# EAGLE design AJH_as3340_20 (EAGLE 9.5.2)
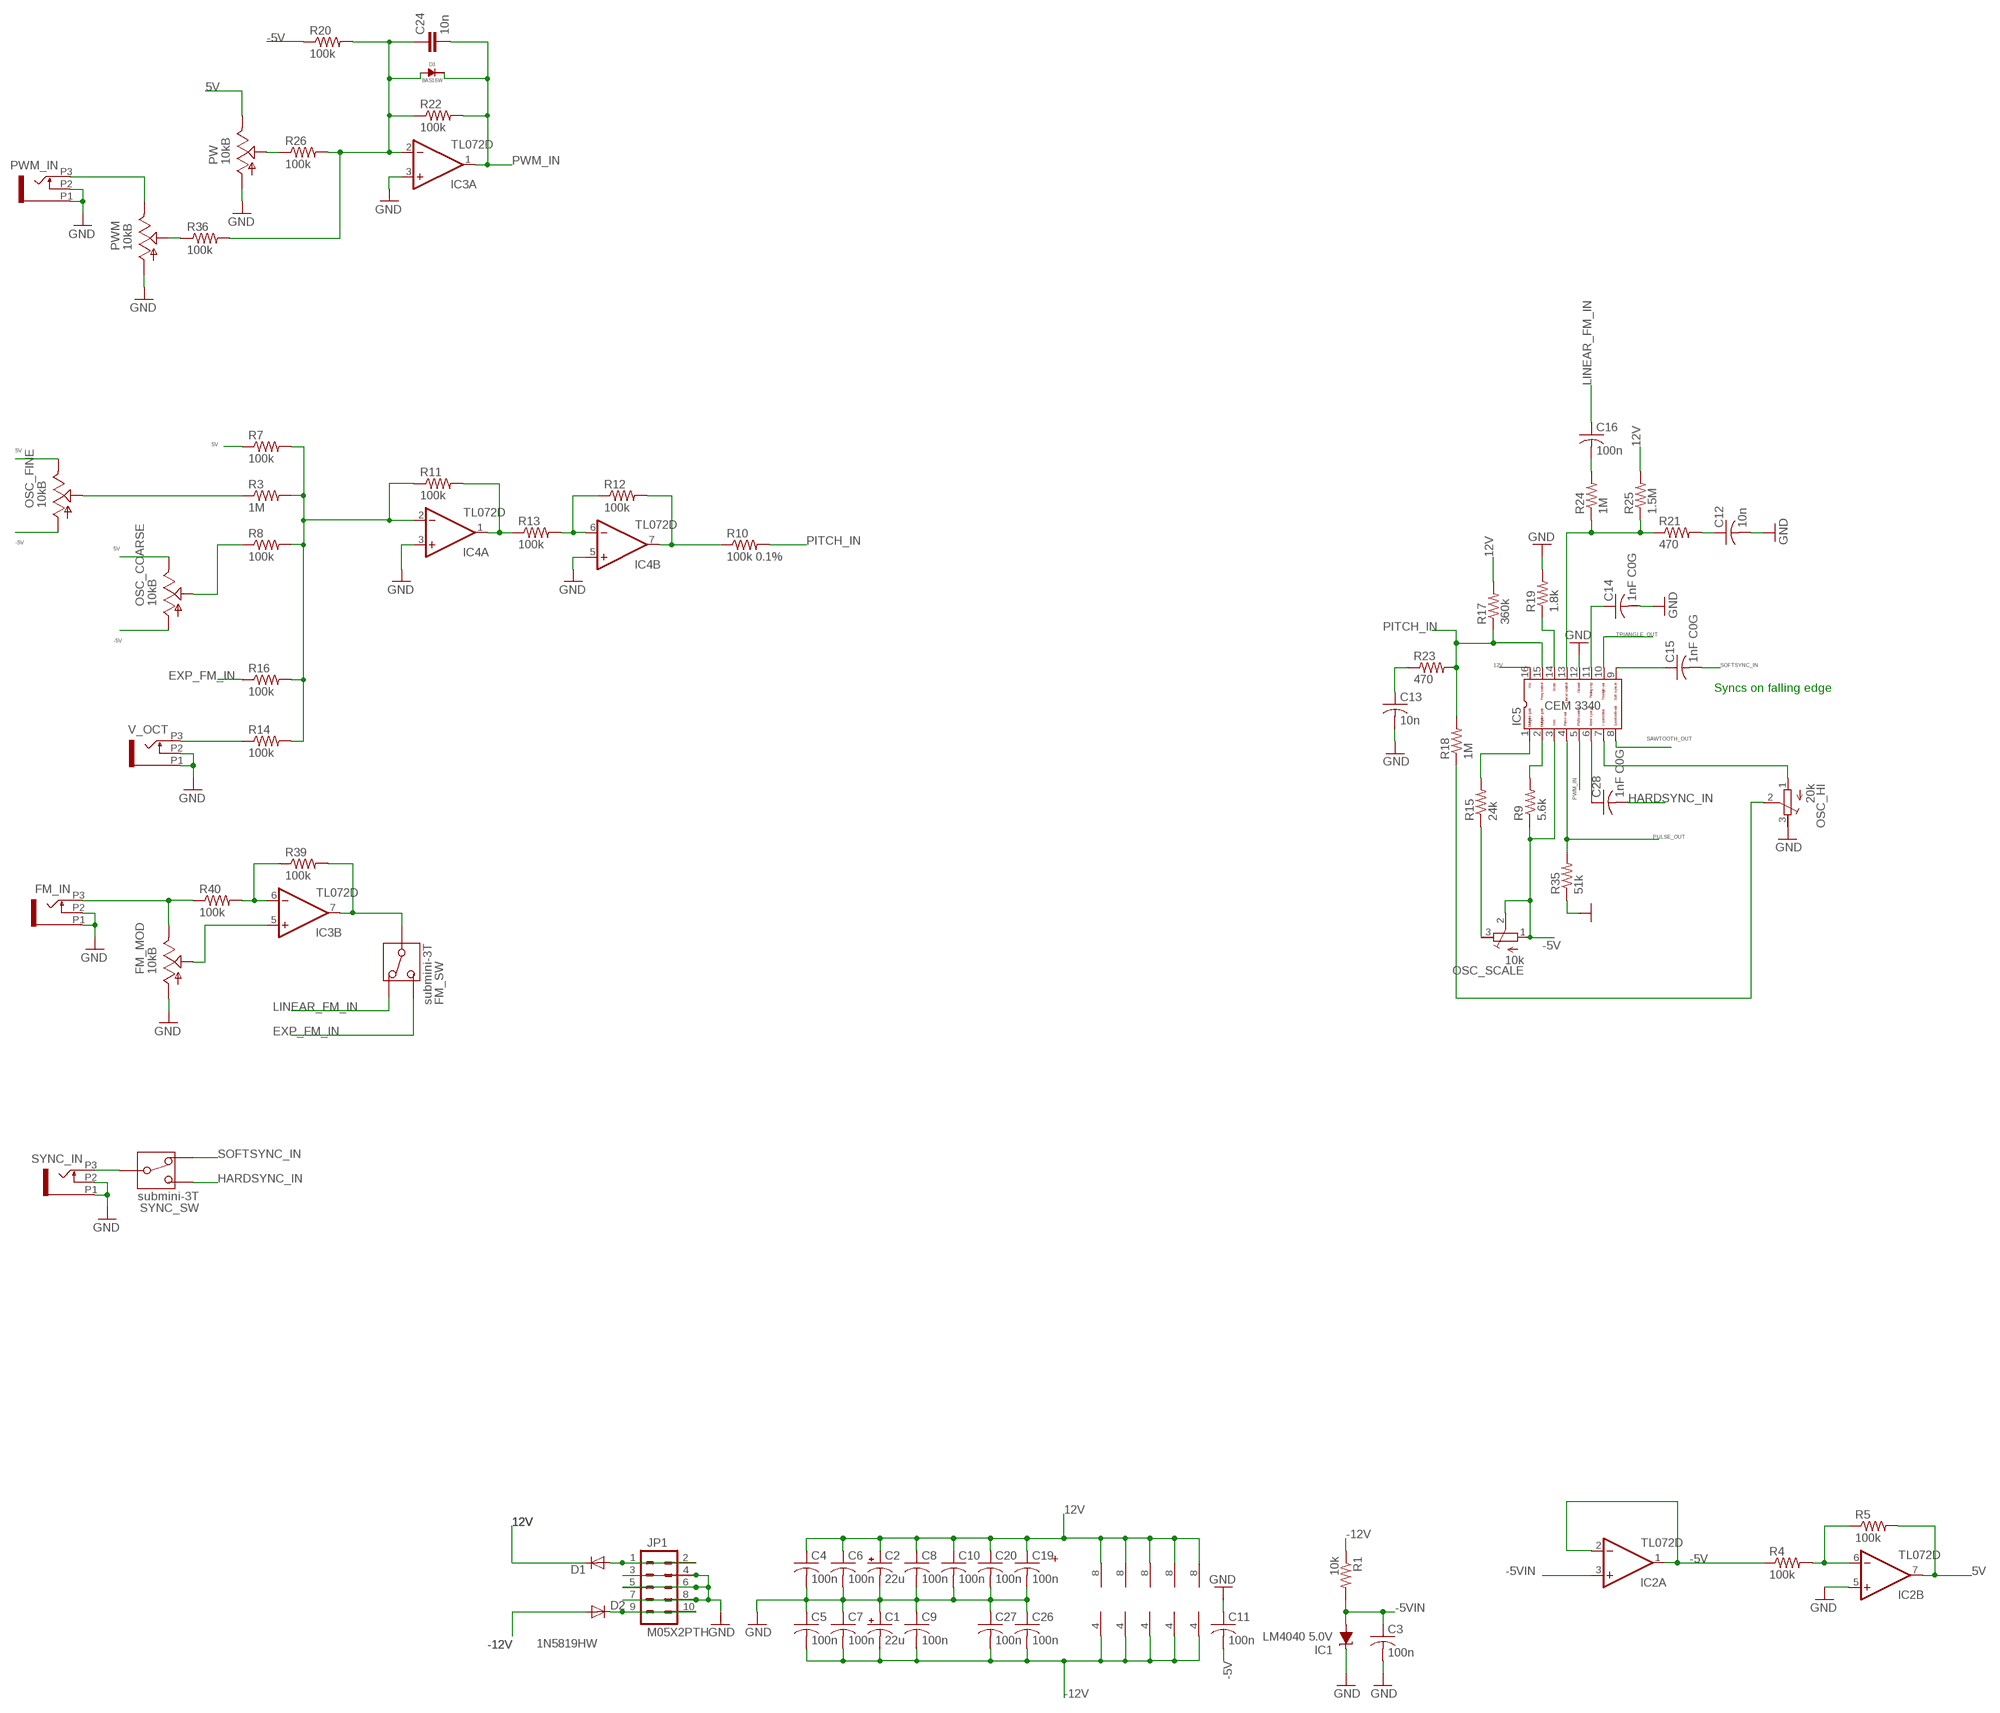
[diagram p0: schematic, sheet 1, part 1 of 2]
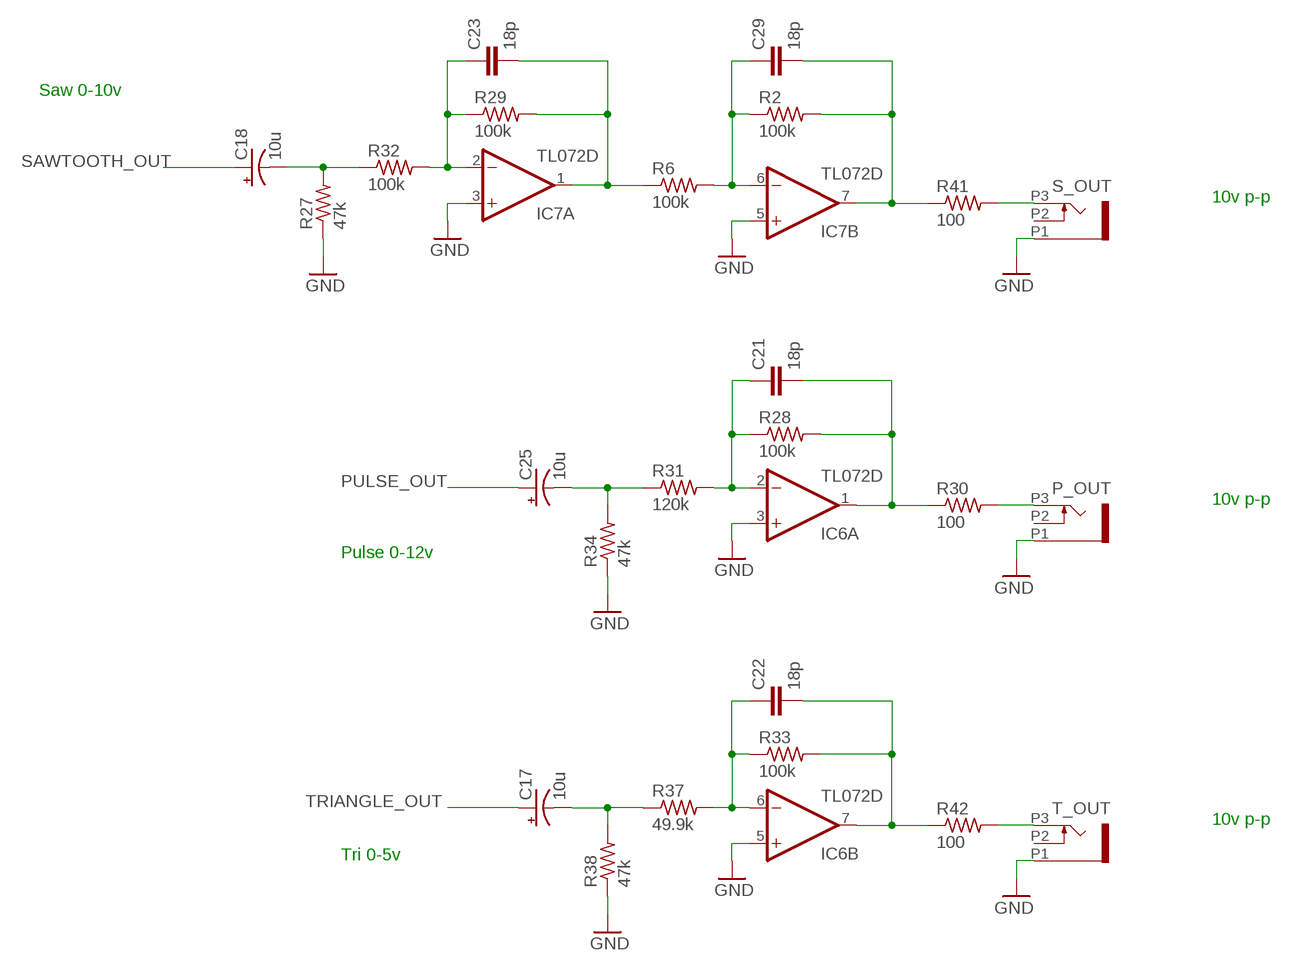
[diagram p1: schematic, sheet 1, part 2 of 2]

## Parts
C1  22u  CPOL-USB  [PANASONIC_B]
C2  22u  CPOL-USB  [PANASONIC_B]
C3  100n  C-USC0603  [C0603]
C4  100n  C-USC0603  [C0603]
C5  100n  C-USC0603  [C0603]
C6  100n  C-USC0603  [C0603]
C7  100n  C-USC0603  [C0603]
C8  100n  C-USC0603  [C0603]
C9  100n  C-USC0603  [C0603]
C10  100n  C-USC0603  [C0603]
C11  100n  C-USC0603  [C0603]
C12  10n  C-USC0603  [C0603]
C13  10n  C-USC0603  [C0603]
C14  1nF C0G  C-USC0603  [C0603]
C15  1nF C0G  C-USC0603  [C0603]
C16  100n  C-USC0603  [C0603]
C17  10u  CPOL-USB  [PANASONIC_B]
C18  10u  CPOL-USB  [PANASONIC_B]
C19  100n  C-USC0603  [C0603]
C20  100n  C-USC0603  [C0603]
C21  18p  C-EUC0603  [C0603]
C22  18p  C-EUC0603  [C0603]
C23  18p  C-EUC0603  [C0603]
C24  10n  C-EUC0603  [C0603]
C25  10u  CPOL-USB  [PANASONIC_B]
C26  100n  C-USC0603  [C0603]
C27  100n  C-USC0603  [C0603]
C28  1nF C0G  C-USC0603  [C0603]
C29  18p  C-EUC0603  [C0603]
D1  1N5819HW  DIODE-SOD123  [SOD123]
D2  1N5819HW  DIODE-SOD123  [SOD123]
D3  BAS16W  [SOT-323]
FM_IN  PJ301_THONKICONN6  [WQP_PJ_301M6]
FM_MOD  10kB  POT_USVERTICAL_PS  [ALPS_POT_VERTICAL_PS]
FM_SW  submini-3T  SPDTT  [SPDT-SUB]
IC1  LM4040 5.0V  LM4041C12DBZ  [DBZ_R-PDSO-G3]
IC2  TL072D  [SO08]
IC3  TL072D  [SO08]
IC4  TL072D  [SO08]
IC5  CEM3340SOIC16  [SO16]
IC6  TL072D  [SO08]
IC7  TL072D  [SO08]
JP1  M05X2PTH  [AVR_ICSP]
OSC_COARSE  10kB  POT_USVERTICAL  [ALPS_POT_VERTICAL]
OSC_FINE  10kB  POT_USVERTICAL  [ALPS_POT_VERTICAL]
OSC_HI  20k  R-TRIMM3296X  [RTRIM3296X]
OSC_SCALE  10k  R-TRIMM3296X  [RTRIM3296X]
P_OUT  PJ301_THONKICONN6  [WQP_PJ_301M6]
PW  10kB  POT_USVERTICAL_PS  [ALPS_POT_VERTICAL_PS]
PWM  10kB  POT_USVERTICAL_PS  [ALPS_POT_VERTICAL_PS]
PWM_IN  PJ301_THONKICONN6  [WQP_PJ_301M6]
R1  10k  R-US_R0603  [R0603]
R2  100k  R-US_R0603  [R0603]
R3  1M  R-US_R0603  [R0603]
R4  100k  R-US_R0603  [R0603]
R5  100k  R-US_R0603  [R0603]
R6  100k  R-US_R0603  [R0603]
R7  100k  R-US_R0603  [R0603]
R8  100k  R-US_R0603  [R0603]
R9  5.6k  R-US_R0603  [R0603]
R10  100k 0.1%  R-US_R0603  [R0603]
R11  100k  R-US_R0603  [R0603]
R12  100k  R-US_R0603  [R0603]
R13  100k  R-US_R0603  [R0603]
R14  100k  R-US_R0603  [R0603]
R15  24k  R-US_R0603  [R0603]
R16  100k  R-US_R0603  [R0603]
R17  360k  R-US_R0603  [R0603]
R18  1M  R-US_R0603  [R0603]
R19  1.8k  R-US_R0603  [R0603]
R20  100k  R-US_R0603  [R0603]
R21  470  R-US_R0603  [R0603]
R22  100k  R-US_R0603  [R0603]
R23  470  R-US_R0603  [R0603]
R24  1M  R-US_R0603  [R0603]
R25  1.5M  R-US_R0603  [R0603]
R26  100k  R-US_R0603  [R0603]
R27  47k  R-US_R0603  [R0603]
R28  100k  R-US_R0603  [R0603]
R29  100k  R-US_R0603  [R0603]
R30  100  R-US_R0603  [R0603]
R31  120k  R-US_R0603  [R0603]
R32  100k  R-US_R0603  [R0603]
R33  100k  R-US_R0603  [R0603]
R34  47k  R-US_R0603  [R0603]
R35  51k  R-US_R0603  [R0603]
R36  100k  R-US_R0603  [R0603]
R37  49.9k  R-US_R0603  [R0603]
R38  47k  R-US_R0603  [R0603]
R39  100k  R-US_R0603  [R0603]
R40  100k  R-US_R0603  [R0603]
R41  100  R-US_R0603  [R0603]
R42  100  R-US_R0603  [R0603]
S_OUT  PJ301_THONKICONN6  [WQP_PJ_301M6]
SYNC_IN  PJ301_THONKICONN6  [WQP_PJ_301M6]
SYNC_SW  submini-3T  SPDTT  [SPDT-SUB]
T_OUT  PJ301_THONKICONN6  [WQP_PJ_301M6]
V_OCT  PJ301_THONKICONN6  [WQP_PJ_301M6]

## Nets
5V [power]: IC2.7(B:OUT) OSC_COARSE.P$1(E) OSC_FINE.P$1(E) PW.P$1(E) R5.2 R7.1
12V [power]: C2.+ C4.1 C6.1 C8.1 C10.1 C19.1 C20.1 D1.C IC2.8(P:V+) IC3.8(P:V+) IC4.8(P:V+) IC5.16 IC6.8(P:V+) IC7.8(P:V+) R17.2 R25.2
-5V [power]: C11.2 IC2.1(A:OUT) IC2.2(A:-IN) IC5.3 OSC_COARSE.P$3(A) OSC_FINE.P$3(A) OSC_SCALE.1(E) OSC_SCALE.2(S) R4.1 R9.1 R20.1
-5VIN [power]: C3.1 IC1.2(A) IC2.3(A:+IN) R1.2
-12V [power]: C1.- C5.2 C7.2 C9.2 C26.2 C27.2 D2.A IC2.4(P:V-) IC3.4(P:V-) IC4.4(P:V-) IC6.4(P:V-) IC7.4(P:V-) R1.1
EXP_FM_IN: FM_SW.P$1 R16.1
GND [power]: C1.+ C2.- C3.2 C4.2 C5.1 C6.2 C7.1 C8.2 C9.1 C10.2 C11.1 C12.2 C13.2 C14.2 C19.2 C20.2 C26.1 C27.1 FM_IN.P1 FM_IN.P2 FM_MOD.P$3(A) IC1.1(C) IC2.5(B:+IN) IC3.3(A:+IN) IC4.3(A:+IN) IC4.5(B:+IN) IC5.12 IC6.3(A:+IN) IC6.5(B:+IN) IC7.3(A:+IN) IC7.5(B:+IN) JP1.3 JP1.4 JP1.5 JP1.6 JP1.7 JP1.8 OSC_HI.3(A) P_OUT.P1 PW.P$3(A) PWM.P$3(A) PWM_IN.P1 PWM_IN.P2 R19.2 R27.1 R34.1 R35.1 R38.1 S_OUT.P1 SYNC_IN.P1 SYNC_IN.P2 T_OUT.P1 V_OCT.P1 V_OCT.P2
HARDSYNC_IN: C28.2 SYNC_SW.P$1
LINEAR_FM_IN: C16.1 FM_SW.P$3
MAIN_CV1: PWM.P$1(E) PWM_IN.P3
N$1: PW.P$2(S) R26.1
N$2: R41.2 S_OUT.P3
N$3: FM_MOD.P$2(S) IC3.5(B:+IN)
N$4: OSC_COARSE.P$2(S) R8.1
N$5: IC3.6(B:-IN) R39.1 R40.2
N$6: D1.A JP1.1 JP1.2
N$7: IC4.2(A:-IN) R3.2 R7.2 R8.2 R11.1 R14.2 R16.2
N$8: IC4.1(A:OUT) R11.2 R13.1
N$9: IC4.6(B:-IN) R12.1 R13.2
N$10: R14.1 V_OCT.P3
N$11: OSC_FINE.P$2(S) R3.1
N$12: FM_SW.P$2 IC3.7(B:OUT) R39.2
N$13: IC2.6(B:-IN) R4.2 R5.1
N$14: P_OUT.P3 R30.2
N$15: C29.1 IC7.6(B:-IN) R2.1 R6.2
N$16: R42.2 T_OUT.P3
N$17: C18.- R27.2 R32.1
N$18: C25.- R31.1 R34.2
N$19: C17.- R37.1 R38.2
N$20: D2.C JP1.9 JP1.10
N$21: C23.1 IC7.2(A:-IN) R29.1 R32.2
N$23: C23.2 IC7.1(A:OUT) R6.1 R29.2
N$24: C21.2 IC6.1(A:OUT) R28.2 R30.1
N$25: C22.2 IC6.7(B:OUT) R33.2 R42.1
N$26: C22.1 IC6.6(B:-IN) R33.1 R37.2
N$27: C21.1 IC6.2(A:-IN) R28.1 R31.2
N$28: C15.1 IC5.9
N$29: C13.1 R23.1
N$30: OSC_HI.2(S) R18.1
N$31: IC5.1 R15.2
N$32: OSC_SCALE.3(A) R15.1
N$33: IC5.2 R9.2
N$34: IC5.14 R19.1
N$35: C14.1 IC5.11
N$36: C12.1 R21.2
N$37: IC5.13 R21.1 R24.1 R25.1
N$38: C16.2 R24.2
N$40: C29.2 IC7.7(B:OUT) R2.2 R41.1
N$82: FM_IN.P3 FM_MOD.P$1(E) R40.1
N$94: C28.1 IC5.6
N$100: IC5.7 OSC_HI.1(E)
N$103: PWM.P$2(S) R36.1
PITCH_IN: IC5.15 R10.2 R17.1 R18.2 R23.2
PRESUMMED_PITCH: IC4.7(B:OUT) R10.1 R12.2
PULSE_OUT: C25.+ IC5.4 R35.2
PWM_2_IN_SUM: C24.1 D3.ANODE IC3.2(A:-IN) R20.2 R22.1 R26.2 R36.2
PWM_IN: C24.2 D3.CATHODE IC3.1(A:OUT) IC5.5 R22.2
SAWTOOTH_OUT: C18.+ IC5.8
SOFTSYNC_IN: C15.2 SYNC_SW.P$3
SYNC_IN: SYNC_IN.P3 SYNC_SW.P$2
TRIANGLE_OUT: C17.+ IC5.10
Unconnected: P_OUT.P2 S_OUT.P2 T_OUT.P2

## Notes on the sheet
- Saw 0-10v
- 10v p-p
- Syncs on falling edge
- 10v p-p
- Pulse 0-12v
- 10v p-p
- Tri 0-5v
- +

## Library data of the parts
C1 C2 C17 C18 C25 = rcl:CPOL-US: POLARIZED CAPACITOR, American symbol
C3-C16 C19 C20 C26-C28 = rcl:C-US: CAPACITOR, American symbol
C21-C24 C29 = resistor:C-EU: CAPACITOR, European symbol
D1 D2 = diode:DIODE-: DIODE
D3 = FenixBase:BAS16W
FM_IN P_OUT PWM_IN S_OUT SYNC_IN T_OUT V_OCT = og-pj301_variations:PJ301_THONKICONN
FM_MOD PW PWM = pot-alps:POT_US
FM_SW SYNC_SW = malekko main:SPDT: SPDT Switch
IC1 = texas:LM4041: PRECISION MICROPOWER SHUNT VOLTAGE REFERENCE Source: http://focus.ti.com/lit/ds/slcs146e/slcs146e.pdf
IC2-IC4 IC6 IC7 = linear:TL072: OP AMP
IC5 = CEM:CEM3340: CEM 3340 VCO
JP1 = og-header:M05X2: Header 5x2 Standard 10-pin dual row 0.1" header. Commonly used with AVR-ISP. Use with Spark Fun Electronics SKU: PRT-00778
OSC_COARSE OSC_FINE = og-pots:POT_US
OSC_HI OSC_SCALE = rcl:R-TRIMM: Trimm resistor
R1-R42 = resistor:R-US_: RESISTOR, American symbol

## Net classes
1 power: width 0.178 mm, drill 0.305 mm, clearance 0.178 mm to class 0, clearance 0.178 mm

## Board
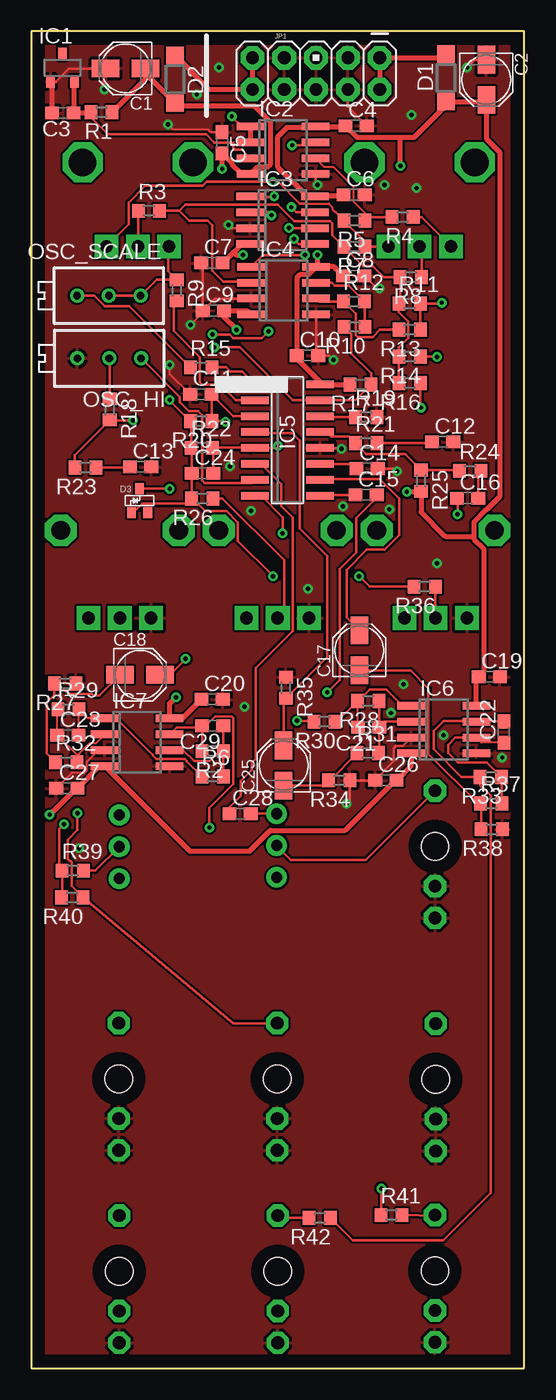
[diagram p2: board, top side]
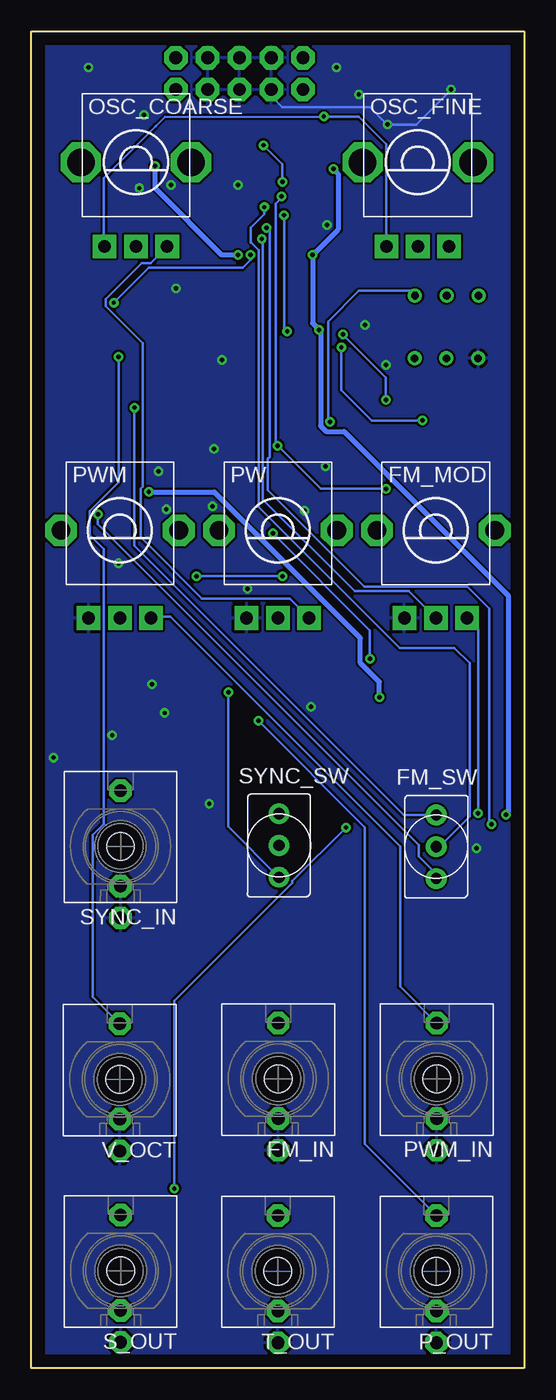
[diagram p3: board, bottom side, seen from below]

Size 39.35 x 106.76 mm. Coordinates in mm from the lower left corner, seen from the top.
Outline: 0,0 39.35,0 39.35,106.76 0,106.76 0,0
Copper layers (1*16): Top 0.035mm / dielectric 1.5mm / Bottom 0.035mm
Design rules "default": minimum track width 6mil, minimum drill 0.35mm, track to track 6mil, track to pad 6mil, pad to pad 6mil, via to via 6mil, smd to smd 6mil, copper to edge 40mil, drill to drill 6mil, minimum pad ring 10mil, minimum via ring 8mil, stop-mask expansion 4mil, vias tented up to drill 0mil, thermal gap 10mil

### Footprints (pad centres in the part's own frame; a part is rotated, then mirrored left to right if it is on the bottom)
PANASONIC_B = smd 2.2 x 1.4: + 1.6,0; - -1.6,0
C0603 = smd 1.1 x 1: 1 -0.85,0; 2 0.85,0
SOD123 = smd 1.4 x 1.4: A 1.9,0; C -1.9,0
SOT-323 = smd 0.7 x 0.9: ANODE -0.65,-0.95; CATHODE 0,0.95; NC 0.65,-0.95
WQP_PJ_301M6 = drill 1.016 pad 1.778 octagon: P1 0,-5.715; P2 0,-3.175; P3 0,4.445 | hole 2.2: 0,0
ALPS_POT_VERTICAL_PS = drill 1 pad 1.88 square: P$1 -2.5,7; P$2 0,7; P$3 2.5,7 | drill 1.5 pad 2.54 octagon: P$4 -4.7,0; P$5 4.7,0
SPDT-SUB = drill 0.889 pad 1.651: P$1 0,2.54; P$2 0,0; P$3 0,-2.54
DBZ_R-PDSO-G3 = smd 0.7 x 1: 1 -0.95,-1.1; 2 0.95,-1.1; 3 0,1.1
SO08 = smd 0.6 x 2.2: 1 -1.905,-2.6; 2 -0.635,-2.6; 3 0.635,-2.6; 4 1.905,-2.6; 5 1.905,2.6; 6 0.635,2.6; 7 -0.635,2.6; 8 -1.905,2.6
SO16 = smd 0.6 x 2.2: 1 -4.445,-2.6; 2 -3.175,-2.6; 3 -1.905,-2.6; 4 -0.635,-2.6; 5 0.635,-2.6; 6 1.905,-2.6; 7 3.175,-2.6; 8 4.445,-2.6; 9 4.445,2.6; 10 3.175,2.6; 11 1.905,2.6; 12 0.635,2.6; 13 -0.635,2.6; 14 -1.905,2.6; 15 -3.175,2.6; 16 -4.445,2.6
AVR_ICSP = drill 1.016 pad 1.88 octagon: 1 -1.27,5.08; 2 1.27,5.08; 3 -1.27,2.54; 4 1.27,2.54; 5 -1.27,0; 6 1.27,0; 7 -1.27,-2.54; 8 1.27,-2.54; 9 -1.27,-5.08; 10 1.27,-5.08
ALPS_POT_VERTICAL = drill 1 pad 1.88 square: P$1 -2.5,6.7; P$2 0,6.7; P$3 2.5,6.7 | drill 2.2 pad 3.175 octagon: P$4 -4.4,0; P$5 4.4,0
RTRIM3296X = drill 0.61: 1 0,-2.54; 2 0,0; 3 0,2.54
R0603 = smd 1 x 1.1: 1 -0.85,0; 2 0.85,0

### Placement (x,y rotation side)
C1  7.52,103.8 180 top
C2  36.32,102.89 270 top
C3  2.51,100.24 180 top
C4  25.93,99.22 0 top
C5  15.24,97.86 270 top
C6  25.77,93.7 0 top
C7  14.42,88.26 0 top
C8  25.73,87.23 0 top
C9  14.53,84.45 0 top
C10  22.05,80.86 0 top
C11  13.53,77.77 0 top
C12  32.83,73.96 0 top
C13  8.73,71.97 0 top
C14  26.8,71.84 0 top
C15  26.73,69.73 0 top
C16  34.83,69.48 0 top
C17  26.18,57.33 90 top
C18  8.68,55.37 0 top
C19  36.56,55.2 0 top
C20  14.43,53.41 0 top
C21  26.92,51.18 180 top
C22  37.72,50.8 90 top
C23  2.92,50.55 0 top
C24  13.67,71.47 0 top
C25  20.15,48.13 90 top
C26  28.31,46.95 0 top
C27  2.84,46.31 0 top
C28  16.67,44.27 0 top
C29  14.48,51.31 180 top
D1  33.1,103.04 90 top
D2  11.48,102.93 270 top
D3  8.64,69.28 0 top
FM_IN  19.64,23.11 0 bottom
FM_MOD  7.06,66.91 180 bottom
FM_SW  7.02,41.64 0 bottom
IC1  2.49,103.85 0 top
IC2  20.09,97.26 270 top
IC3  20.06,91.67 270 top
IC4  20.14,86.05 270 top
IC5  20.45,74.12 270 top
IC6  32.92,50.99 270 top
IC7  8.45,49.98 270 top
JP1  22.73,103.38 270 top
OSC_COARSE  31,96.3 180 bottom
OSC_FINE  8.5,96.3 180 bottom
OSC_HI  6.22,80.65 90 top
OSC_SCALE  6.19,85.65 90 top
P_OUT  7.01,7.75 0 bottom
PW  19.67,66.91 180 bottom
PWM  32.28,66.91 180 bottom
PWM_IN  6.98,23.11 0 bottom
R1  5.61,100.3 180 top
R2  14.48,49.28 180 top
R3  9.4,92.42 0 top
R4  29.64,91.93 180 top
R5  25.8,91.64 180 top
R6  14.48,47.24 0 top
R7  25.8,89.55 180 top
R8  30.3,87.13 180 top
R9  11.62,86.07 270 top
R10  25.8,83.16 180 top
R11  30.2,85.02 0 top
R12  25.76,85.19 0 top
R13  30.2,82.93 180 top
R14  30.2,80.78 180 top
R15  13.56,79.92 0 top
R16  30.2,78.67 180 top
R17  26.27,78.55 180 top
R18  6.27,76.57 270 top
R19  26.73,75.94 0 top
R20  13.56,75.63 180 top
R21  26.73,73.87 0 top
R22  13.61,73.5 0 top
R23  4.33,71.92 180 top
R24  35.03,71.66 0 top
R25  31.11,70.87 270 top
R26  13.64,69.45 180 top
R27  2.7,54.68 180 top
R28  26.9,53.28 180 top
R29  2.97,52.62 0 top
R30  23.41,51.63 180 top
R31  26.86,49.12 0 top
R32  2.8,48.39 0 top
R33  36.69,47.21 180 top
R34  24.59,46.95 180 top
R35  20.32,54.34 270 top
R36  31.4,62.41 180 top
R37  36.72,45.1 0 top
R38  36.76,43.03 180 top
R39  3.31,39.73 0 top
R40  3.26,37.59 180 top
R41  28.75,12.23 0 top
R42  23.03,12.01 180 top
S_OUT  32.22,7.78 0 bottom
SYNC_IN  32.23,41.67 0 bottom
SYNC_SW  19.58,41.74 0 bottom
T_OUT  19.67,7.75 0 bottom
V_OCT  32.29,23.06 0 bottom

### Tracks (layer width: path | path; a pad name or v marks a point on that pad's centre or on a via)
5V  (via drill 0.35)
  Top 0.178: 24.29,92.31 24.03,92.57 24.03,92.72 23.75,93 21.97,93 | R5.2 26.65,89.94 R7.1
  Top 0.203: R7.1 28.45,89.55 OSC_COARSE.P$1 | 24.29,92.31 R5.2 | OSC_FINE.P$1 7.77,91.37 7.77,93.09 9.1,94.41 13.68,94.41 14.01,94.74 v19.3,94.74 19.7,94.74 21.44,93 21.97,93 | IC2.7 22.46,97.66 v20.83,97.66
  Bottom 0.203: v20.83,97.66 19.3,96.14 v19.3,94.74 | PW.P$1 18.73,61.47 25.73,61.47 30.63,66.37 30.63,70.25 30.46,70.42 30.46,81.85 33.42,84.82 33.42,85.36 30.52,88.27 29.84,88.27 OSC_COARSE.P$1
12V  (via drill 0.35)
  Top 0.406: D1.C 33.4,101.14 | 33.4,101.14 36.17,101.14 C2.+ 36.32,98.19 37.39,97.12 37.39,69.6 36.34,68.56 36.3,68.56 35.33,67.59 35.33,66.42 | C6.1 24.82,93.6 22.68,93.6 IC3.8 22.02,93.58 19.68,95.91 19.68,98.35 20.42,99.08 22.61,99.08 IC2.8 22.77,99.09 24.95,99.09 C4.1 26,98.3 29.34,98.3 | C8.1 24.16,87.95 IC4.8 | IC4.8 22.15,87.37 21.48,87.37 21.2,87.08 C10.1 21.2,80.61 23.05,78.76 IC5.16 25.41,78.56 R17.2 | 33.4,101.14 30.56,98.3 29.34,98.3 | C20.1 12.06,51.89 IC7.8 11.05,53.08 v11.56,53.59 | IC6.8 35.52,55.01 C19.1 36.1,55.59 36.1,65.45 35.33,66.22 35.33,66.42 | IC4.8 22.86,88.08 v22.86,88.9 | v29.46,96.01 29.46,98.17 29.34,98.3 | 35.33,66.42 33.06,66.42 31.11,68.37 R25.2 30.02,70.02 v29.97,69.98
  Bottom 0.406: v22.86,88.9 24.13,88.9 29.46,94.23 v29.46,96.01 | v11.56,53.59 11.56,54.81 13.08,56.33 13.08,58.29 24.77,69.98 v29.97,69.98
-5V  (via drill 0.35)
  Top 0.203: OSC_FINE.P$3 10.92,89.6 10.92,87.62 R9.1 10,86.92 OSC_SCALE.1 OSC_SCALE.2 | IC5.3 16.12,76.03 C11.2 14.41,77.74 R20.1 15.43,75.63 v15.49,75.56 | R4.1 31.17,91.93 OSC_COARSE.P$3 | IC2.1 16.79,99.17 v16,99.95
  Top 0.406: IC2.1 IC2.2
  Bottom 0.178: 29.43,99.19 28.67,99.95 v16,99.95
  Bottom 0.203: v16,99.95 13.21,99.95 11,97.74 OSC_FINE.P$3 | OSC_COARSE.P$3 33.57,89.67 33.57,95.05 29.43,99.19 | OSC_SCALE.1 9.11,86.03 13.2,86.03 15.64,83.58 15.64,75.72 v15.49,75.56
-5VIN
  Top 0.203: IC2.3 16.8,97.32 16.27,97.32 16.11,97.48 16.11,97.87 16.11,97.88 14.62,97.88 13.95,98.55 6.1,98.55 4.76,99.89 R1.2
  Top 0.406: R1.2 4.69,100.24 C3.1 3.44,100.32 IC1.2
-12V  (via drill 0.35)
  Top 0.406: 9.12,103.39 D2.A 11.73,100.78 17.84,100.78 19.1,99.52 19.1,96.17 18.88,95.94 18.08,95.94 IC2.4 16.82,95.36 16.01,96.17 16.01,96.23 C5.2 v15.24,95.76 | 9.12,103.39 C1.- | R1.1 9.12,102.97 9.12,103.39 | C7.2 16.15,89.14 | 16.15,89.14 16.77,89.77 IC3.4 | IC4.4 17.23,84.45 C9.2 15.38,83.93 v16.38,82.93 | IC6.4 30.32,48.11 C26.2 29.05,46.95 25.04,42.95 19.08,42.95 17.43,41.3 12.63,41.3 IC7.4 5.46,48.08 C27.2 3.59,46.31 v1.47,44.2 | 16.15,89.14 16.38,88.9 v16.89,88.9
  Bottom 0.406: v15.24,95.76 14.86,95.38 14.86,90.93 v16.89,88.9 16.89,83.44 v16.38,82.93 16.25,82.8 16.25,75.25 15.81,74.81 14.38,74.81 1.29,61.72 1.29,44.37 v1.47,44.2
EXP_FM_IN  (via drill 0.35)
  Top 0.203: R16.1 31.05,76.77 v31.11,76.71
  Bottom 0.203: FM_SW.P$1 9.61,44.18 31.11,65.69 v31.11,76.71
GND  (via drill 0.35)
  Top 0.178: C5.1 14.31,98.71 14.1,98.92 11.32,98.92 v10.92,99.31 | v34.8,103.89 35.4,104.49 C2.- | C27.1 3.25,47.58 4.26,47.58 4.41,47.73 4.41,48.42 5.34,49.35 IC7.3 | IC3.3 16.03,91.03 v15.75,91.31 | C11.1 11.05,79.4 v11.05,80.14
  Top 0.203: IC1.1 1.94,102.75 2.97,103.78 5.9,103.78 C1.+ 5.8,103.68 5.8,102.15 v5.84,102.11 | IC4.3 14.64,85.42 C9.1 | C7.1 13.68,88.15 C9.1 | IC4.5 22.74,81.02 C10.2 23.79,80.86 v24.13,80.52 | IC6.3 29.63,49.67 29.11,49.67 28.94,49.51 28.94,48.47 27.46,46.99 C26.1 R34.1 25.44,45.38 v25.15,45.09 | C8.2 27.58,86.23 v27.81,86.23 | C9.1 13.68,84.29 v12.7,83.31 | C4.2 25.27,100.72 JP1.4 | IC5.12 24.68,73.48 v24.76,73.4 | v22.86,94.51 22.69,94.67 IC2.5 | C14.2 29,71.84 v29.21,71.63
  Top 0.406: C3.2 1.66,102.63 IC1.1
  Bottom 0.203: v5.84,102.11 8.64,99.31 v10.92,99.31 12.32,100.71 19.3,100.71 20.19,101.6 JP1.8
  other vias: 30.35,100.08 37.59,48.77 17.02,52.83 3.81,41.53 13.21,101.73 14.99,103.89 32.38,64.26 30.73,94.23 17.53,68.45 15.88,72.01 24.89,68.83 28.57,68.58 29.72,54.61 32.89,50.55 28.7,52.32 28.19,94.49 22.1,62.23
  pour Top: -1.27,-1.14 40.77,-1.14 40.77,107.95 -0.89,107.95 -0.89,-0.76
  pour Bottom: -0.89,-0.89 40.64,-0.89 40.77,-0.76 40.89,-0.64 40.89,107.95 -0.89,107.95
HARDSYNC_IN
  Top 0.203: SYNC_SW.P$1 17.63,44.28 C28.2
LINEAR_FM_IN  (via drill 0.35)
  Top 0.203: v34.04,68.2 34.04,69.42 C16.1
  Bottom 0.203: FM_SW.P$3 7.02,39.48 8.42,40.88 8.42,41.8 34.04,67.42 v34.04,68.2
MAIN_CV1
  Bottom 0.203: PWM_IN.P3 9.9,30.48 9.9,41.68 28.26,60.03 29.65,60.03 PWM.P$1
N$1
  Top 0.203: R26.1 15.25,69.45 20.18,64.52 20.18,60.41 PW.P$2
N$2
  Top 0.203: R41.2 32.28,12.15 S_OUT.P3
N$3  (via drill 0.35)
  Top 0.203: IC3.5 21.36,89.77 v20.95,90.17
  Bottom 0.203: FM_MOD.P$2 9.22,62.06 13.55,62.06 20.86,69.37 20.86,90.07 v20.95,90.17
N$4
  Top 0.203: R8.1 31.15,89.45 OSC_COARSE.P$2
N$5  (via drill 0.35)
  Top 0.203: v2.61,43.43 2.23,43.05 2.23,39.96 R39.1 2.46,37.64 R40.2 | IC3.6 20.6,91.03 v20.57,91.06
  Bottom 0.203: v2.61,43.43 2.79,43.62 2.79,60.67 4.54,62.42 12.76,62.42 20.46,70.12 20.46,72.64 20.32,72.77 20.32,90.81 v20.57,91.06
N$6
  Top 0.406: JP1.2 JP1.1 32.81,104.65 D1.A
N$7
  Top 0.203: R16.2 R14.2 29.35,81.52 30.1,82.28 30.1,83.58 29.35,84.34 R11.1 29.45,85.12 R8.2 28.12,87.13 27.25,88.01 26.49,88.01 R7.2 24.01,90.49 24.01,91.44 23.86,91.59 20.99,91.59 19.68,92.9 12.28,92.9 11.8,92.42 | IC4.2 17.46,86.77 15.32,86.77 14.44,87.64 14.44,91.26 14.07,91.64 12.59,91.64 11.8,92.42 | 11.8,92.42 R3.2
N$8  (via drill 0.35)
  Top 0.203: R13.1 R11.2 32.7,85.02 v32.77,85.09 | IC4.1 18.48,88.9 v21.84,88.9
  Bottom 0.203: v21.84,88.9 21.84,88.52 22.48,87.88 29.97,87.88 v32.77,85.09
N$9
  Top 0.203: IC4.6 22.97,85.19 R12.1 25.9,84.2 25.9,82.5 26.05,82.35 27.25,82.35 27.83,82.93 R13.2
N$10  (via drill 0.35)
  Top 0.203: v32.38,80.77 R14.1
  Bottom 0.203: v32.38,80.77 32.38,70.74 34.67,68.46 34.67,66.53 33.56,65.42 33.56,43.48 34.45,42.59 34.45,29.66 V_OCT.P3
N$11
  Top 0.203: R3.1 8.55,89.65 OSC_FINE.P$2
N$12  (via drill 0.35)
  Top 0.203: R39.2 5.12,39.73 FM_SW.P$2 | IC3.7 21.16,92.31 v20.75,92.72
  Bottom 0.203: FM_SW.P$2 6.77,41.64 4.35,44.05 4.35,56.3 5.59,57.53 9.96,57.53 21.21,68.79 21.21,89.29 21.81,89.89 21.82,89.89 21.82,91.08 20.75,92.15 v20.75,92.72
N$13
  Top 0.178: IC2.6 23.39,95.92 24.13,95.92 25.74,94.31 25.74,93.16 26.65,92.25 R5.1
  Top 0.203: R5.1 26.94,91.93 R4.2
N$14  (via drill 0.35)
  Top 0.203: R30.2 22.5,51.69 v21.21,51.69
  Bottom 0.203: P_OUT.P3 12.72,17.9 12.72,43.2 v21.21,51.69
N$15
  Top 0.203: R2.1 15.04,49.28 14.23,48.47 13.02,48.47 12.15,49.35 IC7.6 | C29.1 R2.1 | R2.1 R6.2
N$16
  Top 0.203: R42.2 19.85,12.01 T_OUT.P3
N$17
  Top 0.203: R32.1 1.24,49.1 1.24,53.14 1.85,53.76 R27.2 2.1,54.68 2.93,53.85 4.82,53.85 4.95,53.72 5.43,53.72 C18.-
N$18
  Top 0.203: C25.- 23.32,46.53 R34.2 23.85,46.95 R31.1
N$19
  Top 0.203: C17.- 30.27,55.73 31.7,54.3 31.7,49.06 35.66,45.1 R37.1 35.91,45.06 R38.2
N$20
  Top 0.406: JP1.9 JP1.10 14.2,102.11 D2.C
N$21
  Top 0.152: 3.77,48.84 C23.1 2.07,52.57 R29.1 | 3.77,48.84 3.77,48.55 | IC7.2 5.13,49.9 4.64,49.9 3.77,49.03 3.77,48.84
  Top 0.203: 3.77,48.55 3.65,48.42 R32.2
N$23
  Top 0.152: C23.2 3.77,52.41 3.9,52.54
  Top 0.203: R29.2 3.9,52.54 4.49,51.94 5.79,51.94 IC7.1 6.79,51.89 9.69,48.98 9.69,48.94 9.98,48.66 12.26,48.66 12.43,48.49 12.43,48.45 R6.1
N$24
  Top 0.178: C21.2 26.07,52.87 26.27,53.07 | IC6.1 29.66,52.9 | 26.08,53.26
  Top 0.203: 26.27,53.07 26.08,53.26 R28.2 24.4,51.63 R30.1 | 29.66,52.9 28.35,54.2 27.03,54.2 26.08,53.26
N$25
  Top 0.178: C22.2 35.54,51.65 IC6.7
  Top 0.203: IC6.7 35.48,51.68 32.92,51.68 32.11,50.87 32.11,49.44 34.34,47.21 R33.2 35.84,46.55 36.66,45.72 36.66,14 32.9,10.23 25.66,10.23 R42.1
N$26
  Top 0.178: C22.1 35.93,49.95 IC6.6
  Top 0.203: IC6.6 33.85,50.36 33.27,49.78 33.27,49.15 34.04,48.39 36.35,48.39 R33.1 37.57,47.17 R37.2
N$27
  Top 0.178: R28.1 27.77,53.26 | 27.77,49.18 R31.2
  Top 0.203: 27.77,53.26 C21.1 | C21.1 28.22,51.63 IC6.2 | C21.1 27.77,49.18
N$28
  Top 0.152: IC5.9 23.1,69.73
  Top 0.203: 23.1,69.73 C15.1
N$29
  Top 0.203: R23.1 7.83,71.92 C13.1
N$30
  Top 0.203: R18.1 6.27,80.6 OSC_HI.2
N$31
  Top 0.203: IC5.1 16.83,79.58 15.89,79.58 15.55,79.92 R15.2
N$32
  Top 0.203: R15.1 7.82,84.81 5.84,84.81 5,85.65 OSC_SCALE.3
N$33
  Top 0.203: R9.2 11.37,84.97 11.37,82.85 13.46,80.75 13.46,78.74 13.65,78.55 15.05,78.55 16.3,77.3 IC5.2
N$34
  Top 0.203: R19.1 23.13,75.94 IC5.14
N$35
  Top 0.203: IC5.11 25.58,72.22 C14.1
N$36
  Top 0.203: C12.1 31.89,73.87 R21.2
N$37
  Top 0.203: R24.1 34.12,71.72 R25.1 29.84,72.99 26.76,72.99 R21.1 25.37,74.38 23.95,74.38 23.5,74.83 23.12,74.83 IC5.13
N$38
  Top 0.203: C16.2 35.68,71.46 R24.2
N$40  (via drill 0.35)
  Top 0.203: R2.2 13.63,51.18 | 13.63,51.18 C29.2 13.92,51.31 14.67,52.06 15.98,52.06 16.13,51.91 16.13,46.64 14.22,44.73 v14.22,43.18 | IC7.7 11.61,51.18 13.63,51.18 | v27.94,14.35 27.94,12.27 R41.1
  Bottom 0.203: v14.22,43.18 18.5,38.9 18.5,38.75 27.94,29.31 v27.94,14.35
N$82  (via drill 0.35)
  Top 0.203: FM_IN.P3 16.14,27.55 4.22,37.5 | 4.22,37.5 R40.1 | v3.68,44.32 3.68,42.96 2.9,42.18 2.9,41.64 2.92,41.62 2.92,40.68 3.21,40.39 3.21,38.5 4.22,37.5
  Bottom 0.203: v3.68,44.32 3.68,59.02 FM_MOD.P$1
N$94
  Top 0.203: C28.1 15.82,44.81 16.71,45.69 16.71,46.89 17.58,47.76 17.58,48.31 17.91,48.64 17.91,55.9 20.86,58.86 20.86,67.94 19.97,68.83 19.97,70.59 18.42,72.13 17.93,72.13 IC5.6
N$100
  Top 0.203: OSC_HI.1 11.85,77.56 11.85,77.15 12.57,76.43 13.31,76.43 13.63,76.11 13.63,70.9 13.83,70.69 17.6,70.69 IC5.7
N$103
  Top 0.203: R36.1 32.25,59.94 PWM.P$2
PITCH_IN  (via drill 0.35)
  Top 0.203: R17.1 | R17.1 25.87,77.3 IC5.15 20.88,77.3 16.64,81.53 v14.61,81.53 | R23.2 3.48,72.93 R18.2 6.3,75.69 v8.13,75.69 | R17.1 27.12,79.45 25.54,81.03 25.54,82.57 R10.2
  Bottom 0.203: v14.61,81.53 14.61,78.11 12.19,75.69 v8.13,75.69
PRESUMMED_PITCH
  Top 0.203: IC4.7 23.98,86.69 24.21,86.45 25.35,86.45 R12.2 26.61,83.19 R10.1
PULSE_OUT
  Top 0.203: IC5.4 17.93,74.67 20.83,74.67 21.44,74.06 21.44,67.04 23.62,64.86 23.62,56.79 R35.2 20.15,53.32 C25.+
PWM_2_IN_SUM  (via drill 0.35)
  Top 0.152: 12.82,73.45 R22.1 | 12.82,69.48 R26.2
  Top 0.203: R22.1 12.76,75.57 R20.2 11.05,77.28 v11.05,77.34 | v14.48,82.55 15.83,82.55 16.11,82.27 18.39,82.27 v18.92,82.8 | IC3.2 18.95,92.31 v19.18,92.08 | 12.82,73.45 C24.1 12.82,69.48 13.87,68.43 15.6,68.43 16.5,67.54 16.5,66.06 v19.3,63.25 | D3.ANODE 8.13,68.33 8.84,69.04 12.38,69.04 R26.2 | R36.2 27,62.41 v26.16,63.25
  Bottom 0.203: v11.05,77.34 11.05,79.12 v14.48,82.55 | v18.92,82.8 19.18,83.06 v19.18,92.08 | v26.16,63.25 v19.3,63.25
PWM_IN  (via drill 0.35)
  Top 0.152: 14.52,73.46 14.48,73.5
  Top 0.203: R22.2 14.48,73.5 17.17,73.5 17.4,73.28 17.64,73.28 IC5.5 19.51,73.48 v19.69,73.66 | IC3.1 17.54,93.49 19.33,93.49 v19.39,93.56 | C24.2 14.52,73.46 | D3.CATHODE v11.04,70.23 v11.05,70.23
  Bottom 0.152: v19.69,73.66 19.83,73.66
  Bottom 0.203: v19.39,93.56 19.39,93.43 19.83,93 19.83,73.66 | v11.05,70.23 16.26,70.23 v19.69,73.66
SAWTOOTH_OUT  (via drill 0.35)
  Top 0.203: v20.07,66.67 20.07,67.94 18.34,69.67 IC5.8 | v12.32,56.64 10.92,55.24 10.41,55.24 C18.+
  Bottom 0.203: v20.07,66.67 12.32,58.93 v12.32,56.64
SOFTSYNC_IN  (via drill 0.35)
  Top 0.203: v23.62,53.98 24.62,54.97 24.62,63.8 25.95,65.14 25.95,67.91 27.58,69.53 C15.2
  Bottom 0.203: v23.62,53.98 23.62,43.24 SYNC_SW.P$3
SYNC_IN
  Top 0.203: SYNC_IN.P3 26.71,40.6 20.72,40.6 SYNC_SW.P$2
TRIANGLE_OUT
  Top 0.203: IC5.10 23.1,70.99 27.81,70.99 29.36,69.44 29.36,66.53 28.21,65.38 26.8,65.38 25.17,63.75 25.17,59.94 C17.+